# EAGLE design at84Adapter (EAGLE 6.5.0)
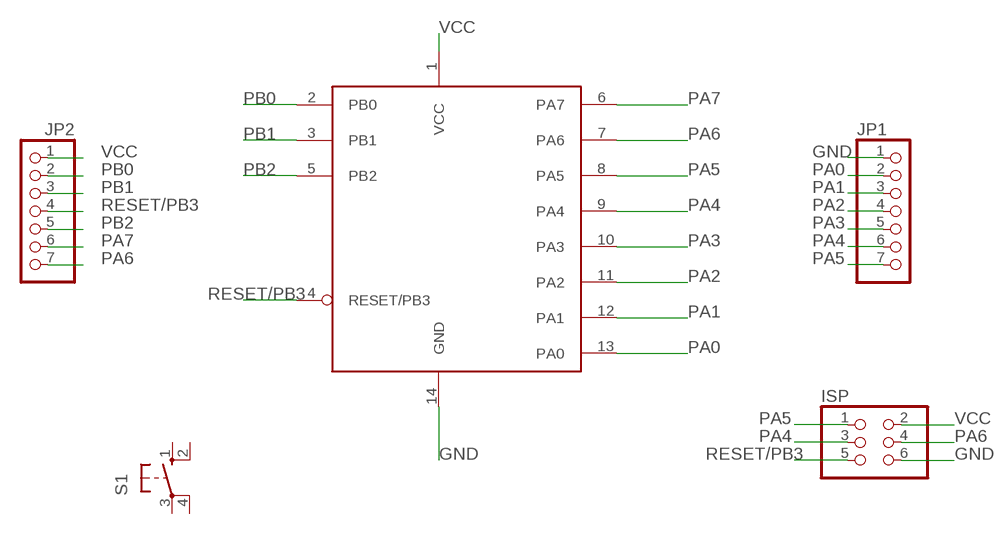
[diagram p0: schematic, sheet 1]

## Parts
ISP  PINHD-2X3  [2X03]
JP1  PINHD-1X7  [1X07]
JP2  PINHD-1X7  [1X07]
S1  10-XX  [B3F-10XX]
U1  AT84  [DIL14]

## Nets
GND: ISP.6 JP1.1 U1.14(GND)
PA0: JP1.2 U1.13(PA0)
PA1: JP1.3 U1.12(PA1)
PA2: JP1.4 U1.11(PA2)
PA3: JP1.5 U1.10(PA3)
PA4: ISP.3 JP1.6 U1.9(PA4)
PA5: ISP.1 JP1.7 U1.8(PA5)
PA6: ISP.4 JP2.7 U1.7(PA6)
PA7: JP2.6 U1.6(PA7)
PB0: JP2.2 U1.2(PB0)
PB1: JP2.3 U1.3(PB1)
PB2: JP2.5 U1.5(PB2)
RESET/PB3: ISP.5 JP2.4 U1.4(RESET/PB3)
VCC: ISP.2 JP2.1 U1.1(VCC)
Unconnected: S1.1(S) S1.2(S1) S1.3(P) S1.4(P1)

## Library data of the parts
ISP = pinhead:PINHD-2X3: PIN HEADER
JP1 JP2 = pinhead:PINHD-1X7: PIN HEADER
S1 = switch-omron:10-XX: OMRON SWITCH; MPN: B3F-1000; OC_FARNELL: 176432; OC_NEWARK: 36M3542
U1 = mroz-lib:AT84: 512B ram,8kB flash,512B EEPROM, USART, 8bit timer/counter, 16bit timer/counter, 10bit ADC, analog comparator

## Board
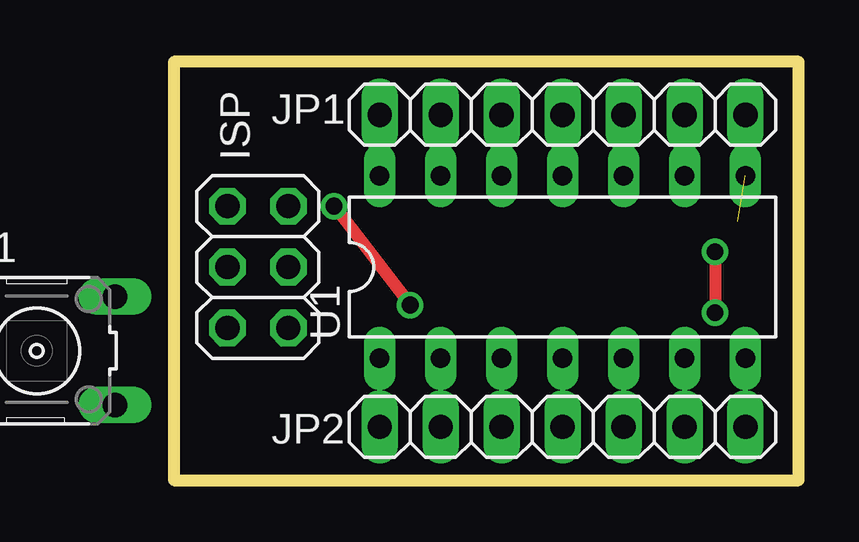
[diagram p1: board, top side]
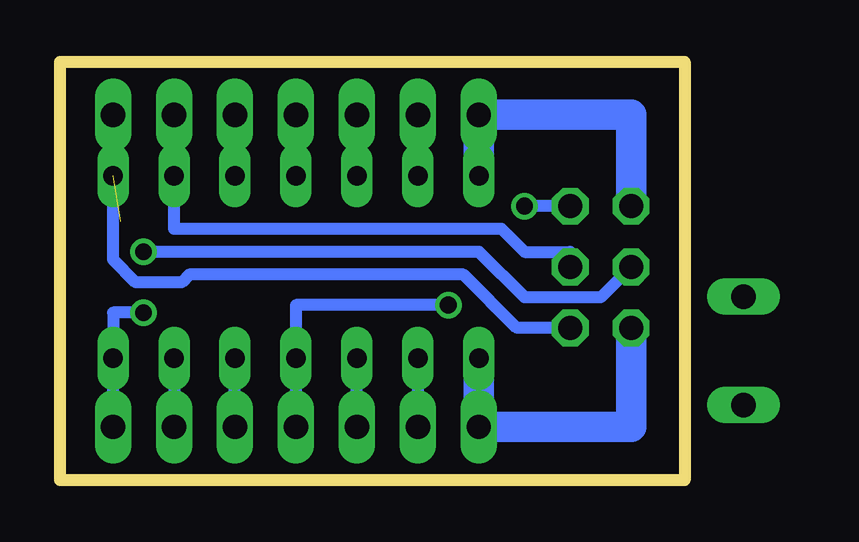
[diagram p2: board, bottom side, seen from below]

Size 26.02 x 17.45 mm. Coordinates in mm from the lower left corner, seen from the top.
Outline: 0,0 26.02,0 26.02,17.45 0,17.45 0,0
Copper layers (1*16): Top 0.035mm / dielectric 1.5mm / Bottom 0.035mm
Design rules "default": minimum track width 10mil, minimum drill 24mil, track to track 8mil, track to pad 8mil, pad to pad 8mil, via to via 8mil, smd to smd 8mil, copper to edge 40mil, drill to drill 8mil, minimum pad ring 10mil, minimum via ring 8mil, stop-mask expansion 4mil, vias tented up to drill 0mil, thermal gap 10mil

### Footprints (pad centres in the part's own frame; a part is rotated, then mirrored left to right if it is on the bottom)
2X03 = drill 1.016 octagon: 1 -2.54,-1.27; 2 -2.54,1.27; 3 0,-1.27; 4 0,1.27; 5 2.54,-1.27; 6 2.54,1.27
1X07 = drill 1.016 long: 1 -7.62,0; 2 -5.08,0; 3 -2.54,0; 4 0,0; 5 2.54,0; 6 5.08,0; 7 7.62,0
B3F-10XX = drill 1.016 long: 1 -3.251,2.261; 2 3.251,2.261; 3 -3.251,-2.261; 4 3.251,-2.261
DIL14 = drill 0.813 long: 1 -7.62,-3.81; 2 -5.08,-3.81; 3 -2.54,-3.81; 4 0,-3.81; 5 2.54,-3.81; 6 5.08,-3.81; 7 7.62,-3.81; 8 7.62,3.81; 9 5.08,3.81; 10 2.54,3.81; 11 0,3.81; 12 -2.54,3.81; 13 -5.08,3.81; 14 -7.62,3.81

### Placement (x,y rotation side)
ISP  3.49,8.89 90 top
JP1  16.19,15.24 0 top
JP2  16.19,2.22 0 top
S1  -5.71,5.4 0 top
U1  16.19,8.89 0 top

### Tracks (layer width: path | path; a pad name or v marks a point on that pad's centre or on a via)
GND
  Bottom 1.27: ISP.6 2.22,15.24 JP1.1 U1.14
PA0
  Bottom 0.508: U1.13 JP1.2
PA1
  Bottom 0.508: JP1.3 U1.12
PA2
  Bottom 0.508: JP1.4 U1.11
PA3
  Bottom 0.508: JP1.5 U1.10
PA4
  Bottom 0.508: JP1.6 U1.9 21.27,10.48 7.62,10.48 6.67,9.53 4.76,9.53 ISP.3
PA5  (1 unrouted)
  Bottom 0.508: JP1.7 U1.8 23.81,9.21 22.86,8.26 20.95,8.26 20.64,8.57 9.21,8.57 6.99,6.35 ISP.1
PA6  (via drill 0.7 pad 0.81)
  Top 0.508: v22.54,9.53 v22.54,6.99
  Bottom 0.508: JP2.7 U1.7 23.81,6.99 v22.54,6.99 | ISP.4 3.49,7.62 6.67,7.62 8.57,9.53 v22.54,9.53
PA7
  Bottom 0.508: U1.6 JP2.6
PB0
  Bottom 0.508: U1.2 JP2.2
PB1
  Bottom 0.508: JP2.3 U1.3
PB2
  Bottom 0.508: JP2.5 U1.5
RESET/PB3  (via drill 0.7 pad 0.81)
  Top 0.508: v6.67,11.43 v9.84,7.3
  Bottom 0.508: JP2.4 U1.4 16.19,7.3 v9.84,7.3 | ISP.5 v6.67,11.43
VCC
  Bottom 1.27: ISP.2 2.22,2.22 JP2.1 U1.1